# EasyEDA Pro project Digital Online Clock.eprj

# Schematic Schematic1
Board Name: Board1; Create Date: 2025-10-27; Page Name: P1; Project Name: Digital Online Clock; Schematic Name: Schematic1; Update Date: 2025-10-29; Company: EasyEDA.com; Page Size: A4; Version: V1.0
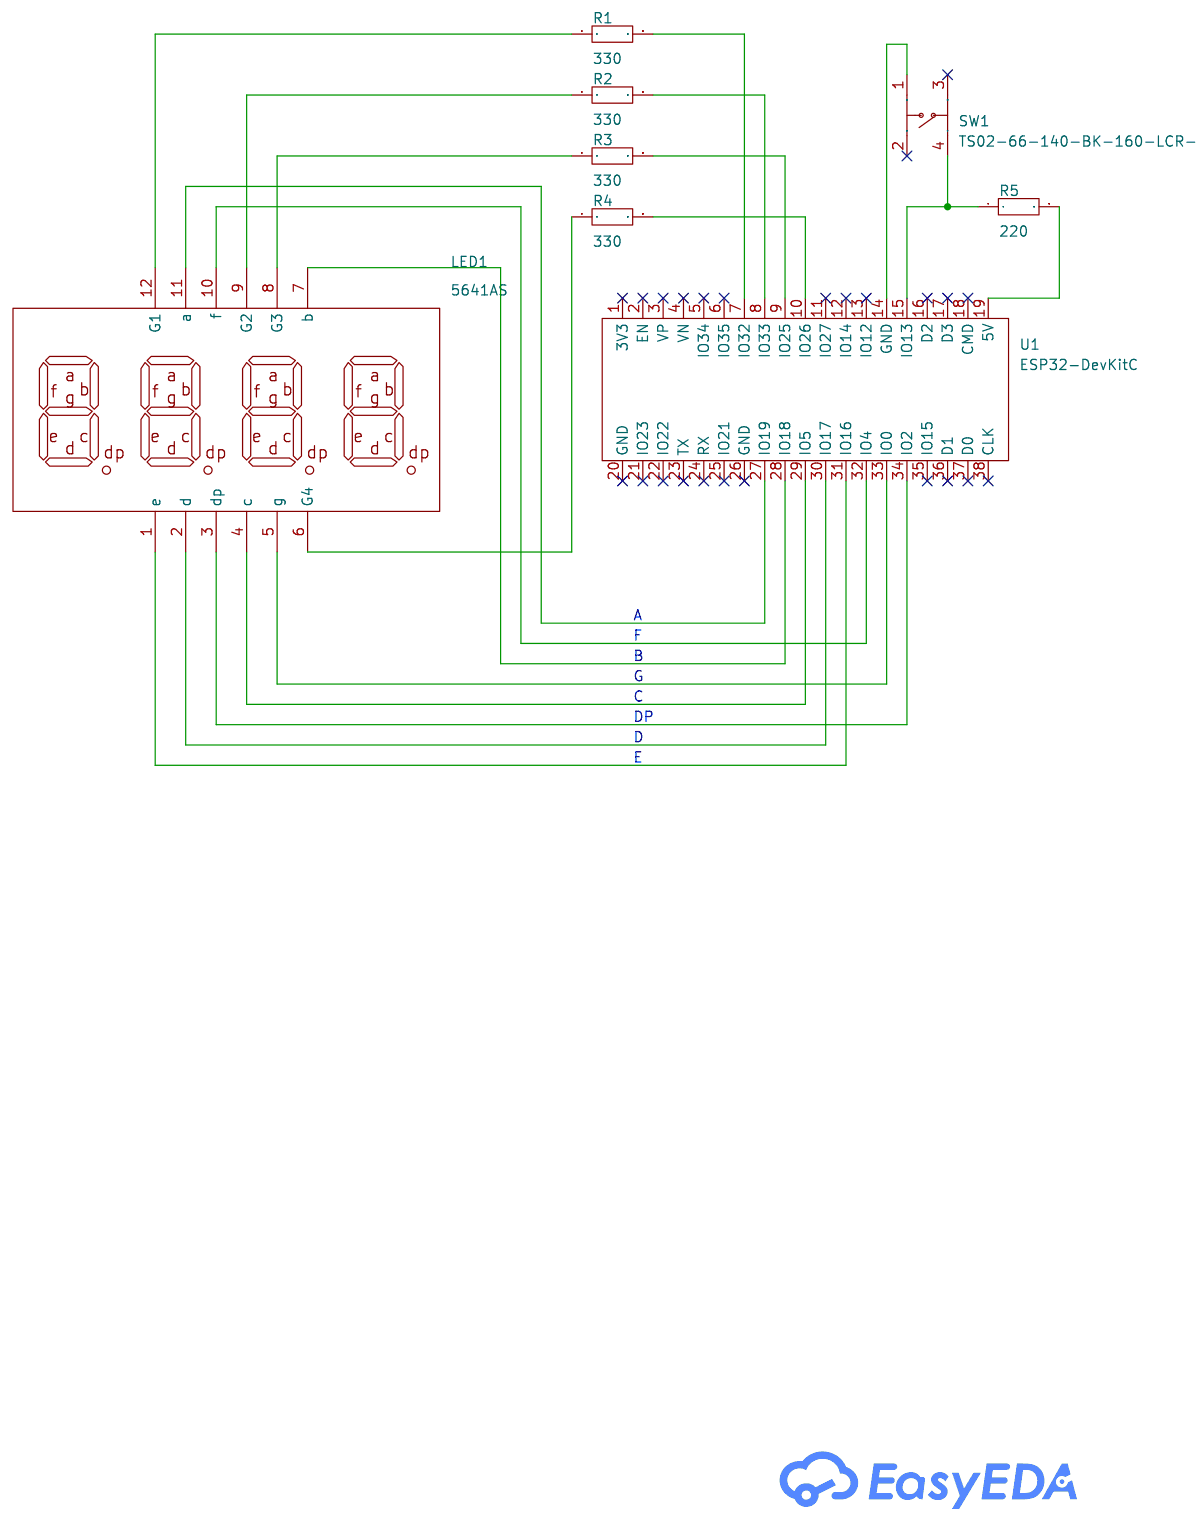
[diagram p0: schematic sheet]

## Parts
LED1  5641AS  [LED-SEG-50x19x8mm-5641AS]
R1  330  [R0603]
R2  330  [R0603]
R3  330  [R0603]
R4  330  [R0603]
R5  220  [R0603]
SW1  TS02-66-140-BK-160-LCR-D  [SW-TH_4P-L6.0-W6.0-P4.50-LS6.5]
U1  ESP32-DevKitC  [BULETM-SMD_ESP32-DEVKITC]

## Library data of the parts
LED1 = 5641AS: LED-SEG-50x19x8mm
R1-R5 = Res_0603: Supplier Footprint: 0603
SW1 = TS02-66-140-BK-160-LCR-D: Supplier Part: C4364272; Manufacturer: CUI Devices; Supplier Footprint: 插件; JLCPCB Part Class: Extended Part; Supplier: LCSC; Circuit: SPST; Actuator Style: Round Button; Operating Force: 160gf; Mounting Style: Straight; Contact Current: 0.05A; Voltage Rating (DC): 12V; Pin Style: PCPin; Mechanical Life: 80000次; Operating Temperature: -30℃~+80℃
U1 = ESP32-DevKitC: LCSC Part Name: 开发板; Supplier Part: C571180; Manufacturer: ESPRESSIF(乐鑫); Datasheet: https://atta.szlcsc.com/upload/public/pdf/source/20200521/C529586_D6FCDAFCFF160B3EDDF7DF28D600699D.pdf; Supplier: LCSC

## Nets
$1N1080: LED1.12(G1) R1.1
$1N1169: LED1.6(G4) R4.1
$1N1242: R3.2 U1.9(IO25)
$1N1255: R4.2 U1.10(IO26)
$1N1329: LED1.9(G2) R2.1
$1N1338: LED1.8(G3) R3.1
$1N1342: LED1.11(a) U1.27(IO19)
$1N1354: LED1.10(f) U1.32(IO4)
$1N1362: LED1.7(b) U1.28(IO18)
$1N1384: LED1.4(c) U1.29(IO5)
$1N1390: LED1.3(dp) U1.34(IO2)
$1N1399: LED1.2(d) U1.30(IO17)
$1N1408: LED1.1(e) U1.31(IO16)
$1N1443: R2.2 U1.8(IO33)
$1N1447: R1.2 U1.7(IO32)
$1N1517: LED1.5(g) U1.33(IO0)
$1N1618: R5.1 SW1.4 U1.15(IO13)
$1N1660: R5.2 U1.19(5V)
$1N1666: SW1.1 U1.14(GND)

Not connected (* = marked no-connect by the designer): SW1 2* 3*; U1 1(3V3)* 2(EN)* 3(VP)* 4(VN)* 5(IO34)* 6(IO35)* 11(IO27)* 12(IO14)* 13(IO12)* 16(D2)* 17(D3)* 18(CMD)* 20(GND)* 21(IO23)* 22(IO22)* 23(TX)* 24(RX)* 25(IO21)* 26(GND)* 35(IO15)* 36(D1)* 37(D0)* 38(CLK)*

## Notes on the sheet
- A
- F
- B
- C
- G
- DP
- D
- E

# Board PCB1
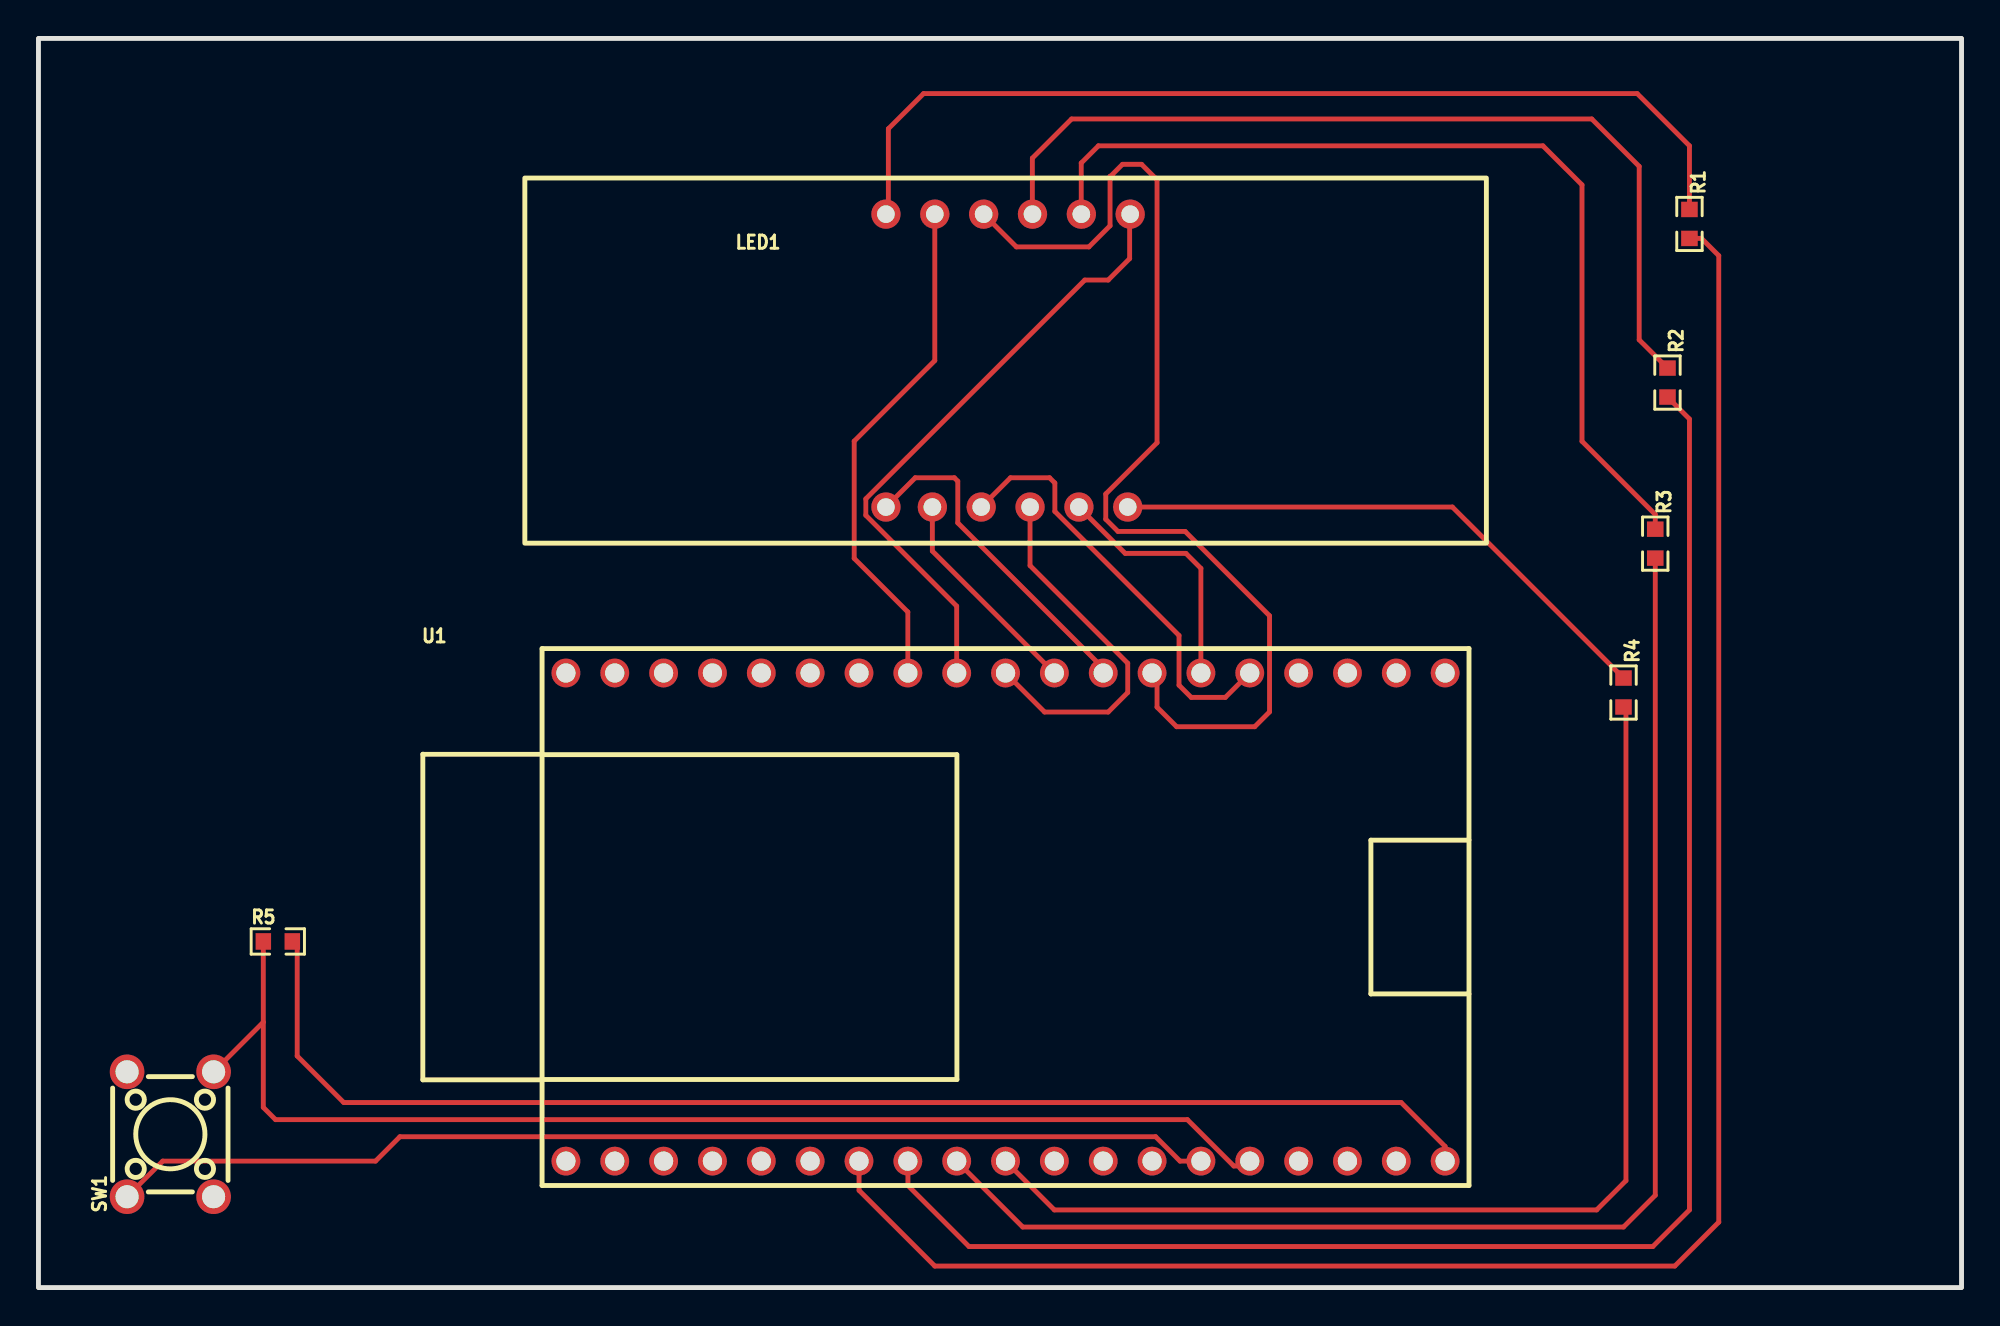
[diagram p1: board, top side]
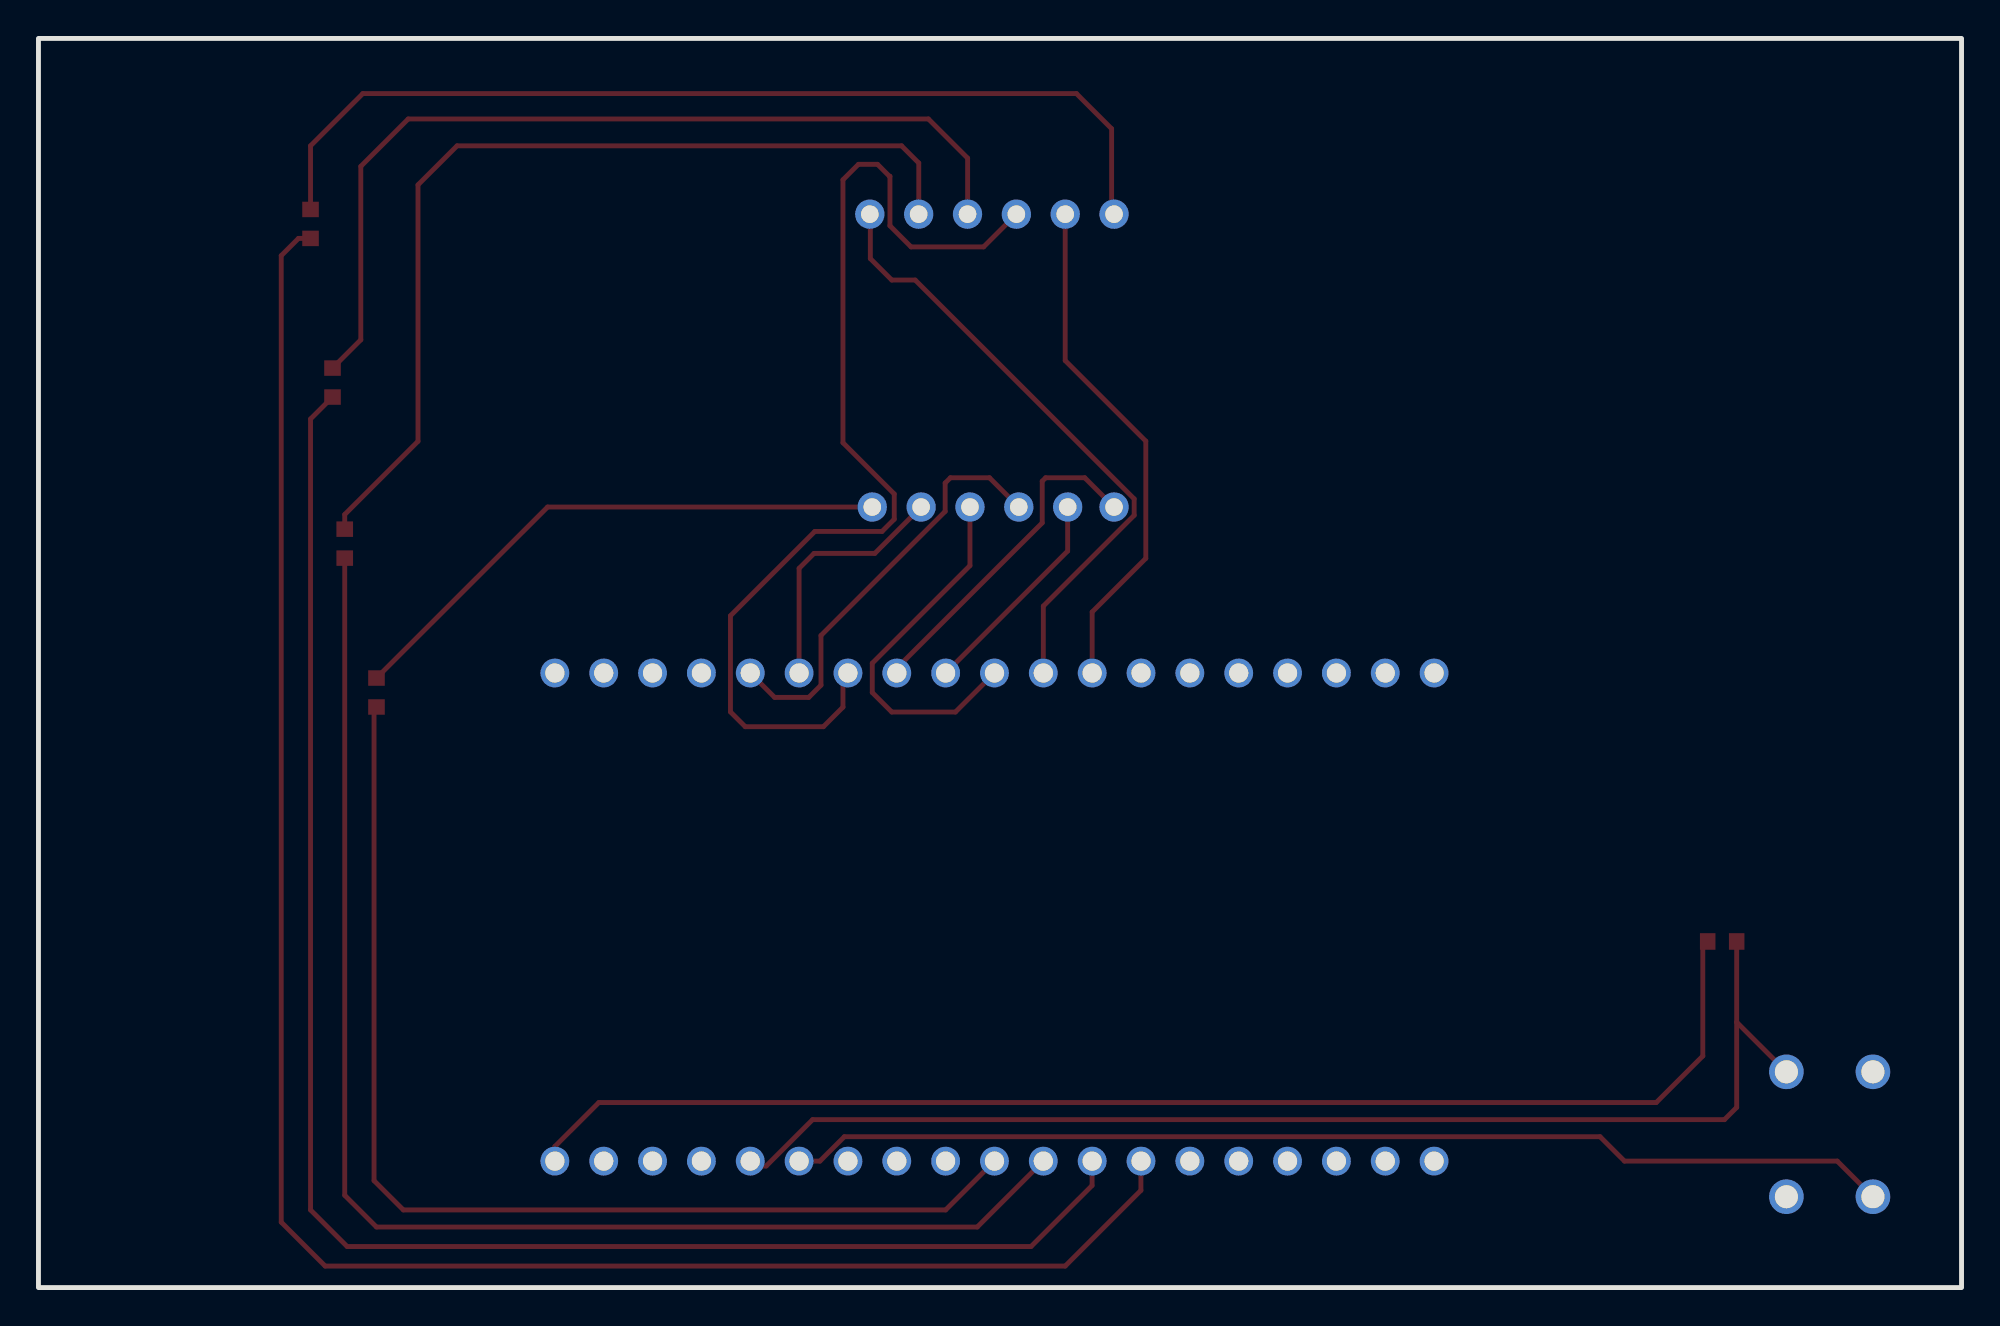
[diagram p2: board, bottom side, seen from below]

Outline 100 x 65 mm; copper layers: Top Layer, Bottom Layer. Coordinates in mm from the lower left corner of the outline.
Outline path: rectangle 0,65 100,0
Stack: Top Layer 0.035mm / Dielectric1 1.51mm FR4 er 4.5 / Bottom Layer 0.035mm

## Design rules (mm)
template: JLCPCB Capability(Two Layers Board)
spacing copperThickness1oz (default): track to track 0.102, other pairs 0.152 to 0.3
spacing copperThickness2oz: track to track 0.203, other pairs 0.152 to 0.3
track width copperThickness1oz (default): min 0.127, default 0.254, max 2.54
track width copperThickness2oz: min 0.203, default 0.254, max 2.54
differential pair differentialPair (default): width min 0.127, default 0.254, max 2.54; gap min 0.152, default 0.152
via viaSize (default): diameter min 0.5, default 0.61, max 10; hole min 0.3, default 0.305, max 6.3

## Placement (name value [footprint] x y rotation side)
LED1  5641AS  [LED-SEG-50x19x8mm-5641AS]  50.29 48.24 0 top
R1  330  [R0603]  85.85 55.35 270 top
R2  330  [R0603]  84.71 47.09 270 top
R3  330  [R0603]  84.07 38.71 270 top
R4  330  [R0603]  82.42 30.96 270 top
R5  220  [R0603]  12.45 18.01 0 top
SW1  TS02-66-140-BK-160-LCR-D  [SW-TH_4P-L6.0-W6.0-P4.50-LS6.5]  6.86 7.98 90 top
U1  ESP32-DevKitC  [BULETM-SMD_ESP32-DEVKITC]  50.29 19.28 0 top

## Footprints (pads in the part's own frame, mm; a bottom-side part is the same pattern mirrored in y, then rotated)
BULETM-SMD_ESP32-DEVKITC
  round 1.5 hole 1: 1(-22.86,-12.7) 2(-20.32,-12.7) 3(-17.78,-12.7) 4(-15.24,-12.7) 5(-12.7,-12.7) 6(-10.16,-12.7) 7(-7.62,-12.7) 8(-5.08,-12.7) 9(-2.54,-12.7) 10(0,-12.7) 11(2.54,-12.7) 12(5.08,-12.7) 13(7.62,-12.7) 14(10.16,-12.7) 15(12.7,-12.7) 16(15.24,-12.7) 17(17.78,-12.7) 18(20.32,-12.7) 19(22.86,-12.7) 20(-22.86,12.7) 21(-20.32,12.7) 22(-17.78,12.7) 23(-15.24,12.7) 24(-12.7,12.7) 25(-10.16,12.7) 26(-7.62,12.7) 27(-5.08,12.7) 28(-2.54,12.7) 29(0,12.7) 30(2.54,12.7) 31(5.08,12.7) 32(7.62,12.7) 33(10.16,12.7) 34(12.7,12.7) 35(15.24,12.7) 36(17.78,12.7) 37(20.32,12.7) 38(22.86,12.7)
LED-SEG-50x19x8mm-5641AS
  round 1.524 hole 0.914: 1(-6.223,-7.62) 2(-3.81,-7.62) 3(-1.27,-7.62) 4(1.27,-7.62) 5(3.81,-7.62) 6(6.35,-7.62) 7(6.477,7.62) 8(3.937,7.62) 9(1.397,7.62) 10(-1.143,7.62) 11(-3.683,7.62) 12(-6.223,7.62)
R0603
  rect 0.806x0.864 smd: 1(-0.753,0) 2(0.753,0)
SW-TH_4P-L6.0-W6.0-P4.50-LS6.5
  round 1.8 hole 1.2: 1(-3.25,2.25) 2(3.25,2.25) 3(-3.25,-2.25) 4(3.25,-2.25)

## Nets
As in the schematic.

Pads without a net: SW1 2 3; U1 1 2 3 4 5 6 11 12 13 16 17 18 20 21 22 23 24 25 26 35 36 37 38

## Routing (per net, layer and track width the routed paths; a pad name or vN(x,y) marks a point on that pad's centre or on a via; arc(x,y) is an arc through that point)
$1N1080: length 51.4
  Top Layer w0.254: R1.1 85.85,59.41 83.13,62.13 46.03,62.13 44.2,60.3 44.2,55.99 44.06,55.86
$1N1169: length 29.5
  Top Layer w0.254: R4.1 73.52,40.62 56.64,40.62
$1N1242: length 71.6
  Top Layer w0.254: R3.2 84.07,4.8 82.42,3.15 51.18,3.15 47.75,6.58 U1.9
$1N1255: length 58.6
  Top Layer w0.254: R4.2 82.55,30.08 82.55,5.56 81.03,4.04 52.83,4.04 U1.10
$1N1329: length 47.4
  Top Layer w0.254: R2.1 83.24,49.32 83.24,58.34 80.77,60.81 53.72,60.81 51.68,58.77 51.68,55.86
$1N1338: length 49.4
  Top Layer w0.254: R3.1 84.07,40.23 80.26,44.04 80.26,57.38 78.23,59.41 55.12,59.41 54.22,58.52 54.22,55.86
$1N1342: length 26.8
  Top Layer w0.254: U1.27 45.21,35.16 42.42,37.94 42.42,44.05 46.61,48.24 LED1.11
$1N1354: length 56.2
  Top Layer w0.254: 49.14,55.86 49.15,55.85 ; U1.32 58.17,31.72 58.17,30.2 59.18,29.19 63.25,29.19 64.02,29.96 64.02,34.96 59.63,39.35 56.13,39.35 55.5,39.98 55.5,41.3 58.17,43.96 58.17,57.64 57.36,58.45 56.37,58.45 55.75,57.83 55.72,57.83 55.72,55.25 54.62,54.15 50.85,54.15 LED1.10
$1N1362: length 32.2
  Top Layer w0.254: U1.28 47.75,35.46 43.02,40.19 43.02,41.04 54.41,52.43 55.63,52.43 56.74,53.54 56.74,55.83 LED1.7
$1N1384: length 19.4
  Top Layer w0.254: U1.29 52.32,29.95 55.63,29.95 56.64,30.96 56.64,32.49 51.56,37.57 LED1.4
$1N1390: length 22.2
  Top Layer w0.254: LED1.3 50.55,42.14 52.58,42.14 52.85,41.87 52.85,40.39 59.31,33.93 59.31,31.34 59.94,30.71 61.72,30.71 U1.34
$1N1399: length 11.3
  Top Layer w0.254: LED1.2 46.48,38.33 U1.30
$1N1408: length 17.6
  Top Layer w0.254: LED1.1 45.59,42.14 47.62,42.14 47.8,41.96 47.8,39.79 55.37,32.23 U1.31
$1N1443: length 86.8
  Top Layer w0.254: U1.8 45.21,6.57 45.21,5.31 48.39,2.13 83.95,2.13 85.85,4.04 85.85,45.2 R2.2
$1N1447: length 101
  Top Layer w0.254: R1.2 86.48,54.59 87.38,53.7 87.38,3.41 85.09,1.12 46.61,1.12 42.67,5.06 42.67,6.57 U1.7
$1N1517: length 13.1
  Top Layer w0.254: U1.33 60.45,37.42 59.67,38.2 56.51,38.2 54.1,40.62
$1N1618: length 65
  Top Layer w0.254: 11.69,13.81 R5.1 ; 11.69,13.81 SW1.4 ; 11.69,13.81 11.69,9.37 12.33,8.74 59.74,8.74 62.16,6.33 62.73,6.33 U1.15
$1N1660: length 68.5
  Top Layer w0.254: R5.2 13.45,17.76 13.45,12.05 15.88,9.63 70.86,9.63 73.15,7.34 U1.19
$1N1666: length 57.7
  Top Layer w0.254: U1.14 59.36,6.58 58.09,7.85 18.8,7.85 17.53,6.58 6.46,6.58 SW1.1
